# Altium schematic sheet Buttons.SchDoc
size A4; Organization: Rotronic AG; Address1: Grindelstrasse 6; Address2: 8303 Bassersdorf; Address3: Switzerland; DocumentNumber: 3; SheetNumber: 3; SheetTotal: 10; Web_Address: www.rotronic.ch; E_Mail_Address: *@rotronic.ch; Fon: +41 (0)44 838 11 11; Fax: +41 (0)44 836 44 24
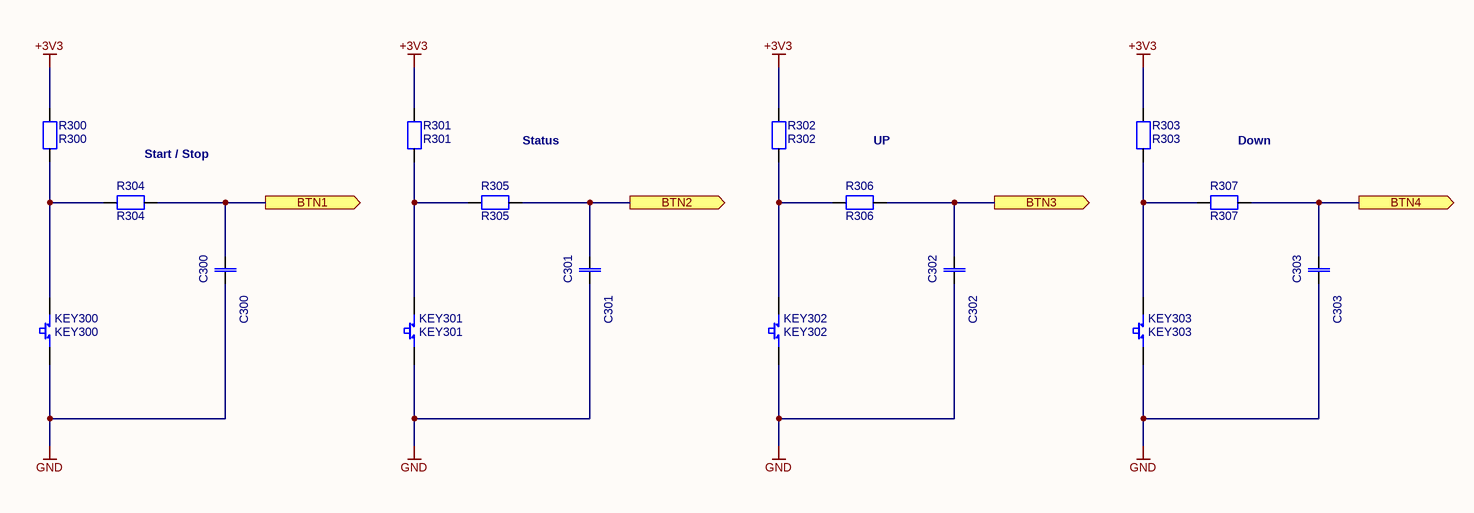
[diagram p0: Buttons.SchDoc]

## Parts
C300  C300  [0603-1608]
C301  C301  [0603-1608]
C302  C302  [0603-1608]
C303  C303  [0603-1608]
KEY300  KEY300  [SW_TL9210AF180Q]
KEY301  KEY301  [SW_TL9210AF180Q]
KEY302  KEY302  [SW_TL9210AF180Q]
KEY303  KEY303  [SW_TL9210AF180Q]
R300  R300  [0603-1608]
R301  R301  [0603-1608]
R302  R302  [0603-1608]
R303  R303  [0603-1608]
R304  R304  [0603-1608]
R305  R305  [0603-1608]
R306  R306  [0603-1608]
R307  R307  [0603-1608]

## Ports
BTN1 (out), BTN2 (out), BTN3 (out), BTN4 (out)

## Nets
+3V3: R300.1 R301.1 R302.1 R303.1
GND: C300.2 C301.2 C302.2 C303.2 KEY300.1 KEY301.1 KEY302.1 KEY303.1
BTN1: C300.1 R304.2 ; port BTN1
BTN2: C301.1 R305.2 ; port BTN2
BTN3: C302.1 R306.2 ; port BTN3
BTN4: C303.1 R307.2 ; port BTN4
NetKEY300_2: KEY300.2 R300.2 R304.1
NetKEY301_2: KEY301.2 R301.2 R305.1
NetKEY302_2: KEY302.2 R302.2 R306.1
NetKEY303_2: KEY303.2 R303.2 R307.1

## Notes on the sheet
- (near R304) Start / Stop
- Status
- UP
- Down
- Byte Overflow - DIY Electronics projects
- mootseeker98@gmail.com
- Revision
- AD-Version
- Designer
- Datum
- elektronisch signiert
- Sheet
- of

## Library data of the parts
C300-C303 = F0161: Capacitor; Part-Number: 63.0104.1450; Manufacturer: KEMET; Manufacturer Part Number: C0603C104K5RACTU; Designator: C 100nF 50V X7R; ID: F0161; Operating Range: -55°C to +125°C; Note: 100nF 50V X7R 10% Kemet C0603C104K5RACTU; Specification: 05.09.2013 OPT; Value: 100nF 50V; Component Type: Standard; ComponentLink1Description: Datasheet; ComponentLink1URL: http://www.kemet.com/kemet/web/homepage/kechome.nsf/vapubfiles/KEM_C1002_X7R_SMD.pdf/$file/KEM_C1002_X7R_SMD.pdf; Status: Active; Availability Date: 15.11.2016 OPT; RoHS compliant: Yes; Flammability: n.a.; Pin Count: 2; Price 100: 0.007; Price 1000: 0.007; Price Date: 02.12.2019 Pro Alpha; Changed: 05.09.2013 OPT; Price: 0.01; Supplier 1: Digi-Key; Supplier Part Number 1: 399-5089-1-ND; Part Status: Active; RoHS: RoHS Compliant
KEY300-KEY303 = O0015: Button; Part-Number: 00.0000.0000; Manufacturer: E-Switch; ID: O0015; Operating Range: -20°C to +60°C; Note: Sensorschalter 180gF SPST LngTravel 50mA 12VDC 200gF; Specification: 05.11.2022 PEK; Value: TL9210AF180Q; Component Type: Standard; ComponentLink1Description: Datasheet; ComponentLink1URL: https://www.mouser.ch/datasheet/2/140/e-switch_TL9210-1165861.pdf; Status: Active; Availability Date: 05.11.2022 PEK; RoHS compliant: Yes; Flammability: n.a.; Pin Count: 2; Price 100: 0.61; Price 1000: 0.38; Price Date: 05.11.2022 PEK; Changed: 05.11.2022 PEK; Price: 0.63; Supplier 1: Mouser; Supplier Part Number 1: 612-TL9210AF180Q; Manufacturer Part Number: TL9210AF180Q; Part Status: Active; RoHS: RoHS Compliant; Designator: TL9210AF180Q
R300-R303 = Q0017: Resistor; Part-Number: 71.1002.1300; Manufacturer: Vishay Dale; Manufacturer Part Number: CRCW060310K0FKEAHP; Designator: R 10k 1%; ID: Q0017; Operating Range: -55°C to +155°C; Note: 10k 1% 100ppm 1/10W Vishay CRCW060310K0FKEA; Changed: 19.09.2011 MLP; Verification: 05.07.2012 OPT; Value: 10k; Component Type: Standard; ComponentLink1Description: http://www.vishay.com/docs/20043/crcwhpe3.pdf; ComponentLink1URL: http://www.vishay.com/docs/20043/crcwhpe3.pdf; Status: Active; Availability Date: 16.11.2016 OPT; RoHS compliant: Yes; Flammability: n.a.; Pin Count: 2; Price 100: 0.002; Price 1000: 0.002; Price Date: 02.12.2019 Pro Alpha; Specification: 19.09.2011 MLP; Price: 0.001; Supplier: Digi-Key; Supplier Part Number: 541-10.0KSCT-ND; Part Status: Active; RoHS: RoHS Compliant
R304-R307 = Q0011: Resistor; Part-Number: 71.1000.1300; Manufacturer: Vishay Dale; Manufacturer Part Number: CRCW0603100RFKEA; Designator: R 100E 1%; ID: Q0011; Operating Range: -55°C to +155°C; Note: 100E 1% 100ppm 1/10W Vishay / Dale CRCW0603100RFKTB; Changed: 19.09.2011 MLP; Verification: 05.07.2012 OPT; Value: 100E 1%; Component Type: Standard; ComponentLink1Description: http://www.vishay.com/docs/20035/dcrcwe3.pdf; ComponentLink1URL: http://www.vishay.com/docs/20035/dcrcwe3.pdf; Status: Active; Availability Date: 16.11.2016 OPT; RoHS compliant: Yes; Flammability: n.a.; Pin Count: 2; Price 100: 0.002; Price 1000: 0.002; Price Date: 02.12.2019 Pro Alpha; Specification: 19.09.2011 MLP; Price: 0.002; Supplier: Digi-Key; Supplier Part Number: 541-100HCT-ND; Part Status: Active; RoHS: RoHS Compliant